# EasyEDA schematic CT.json
TITLE: Sheet_1; REV: 1.0; Date: 2021-08-13; Sheet: 1/1; Drawn By: roberttco; Company: Your Company
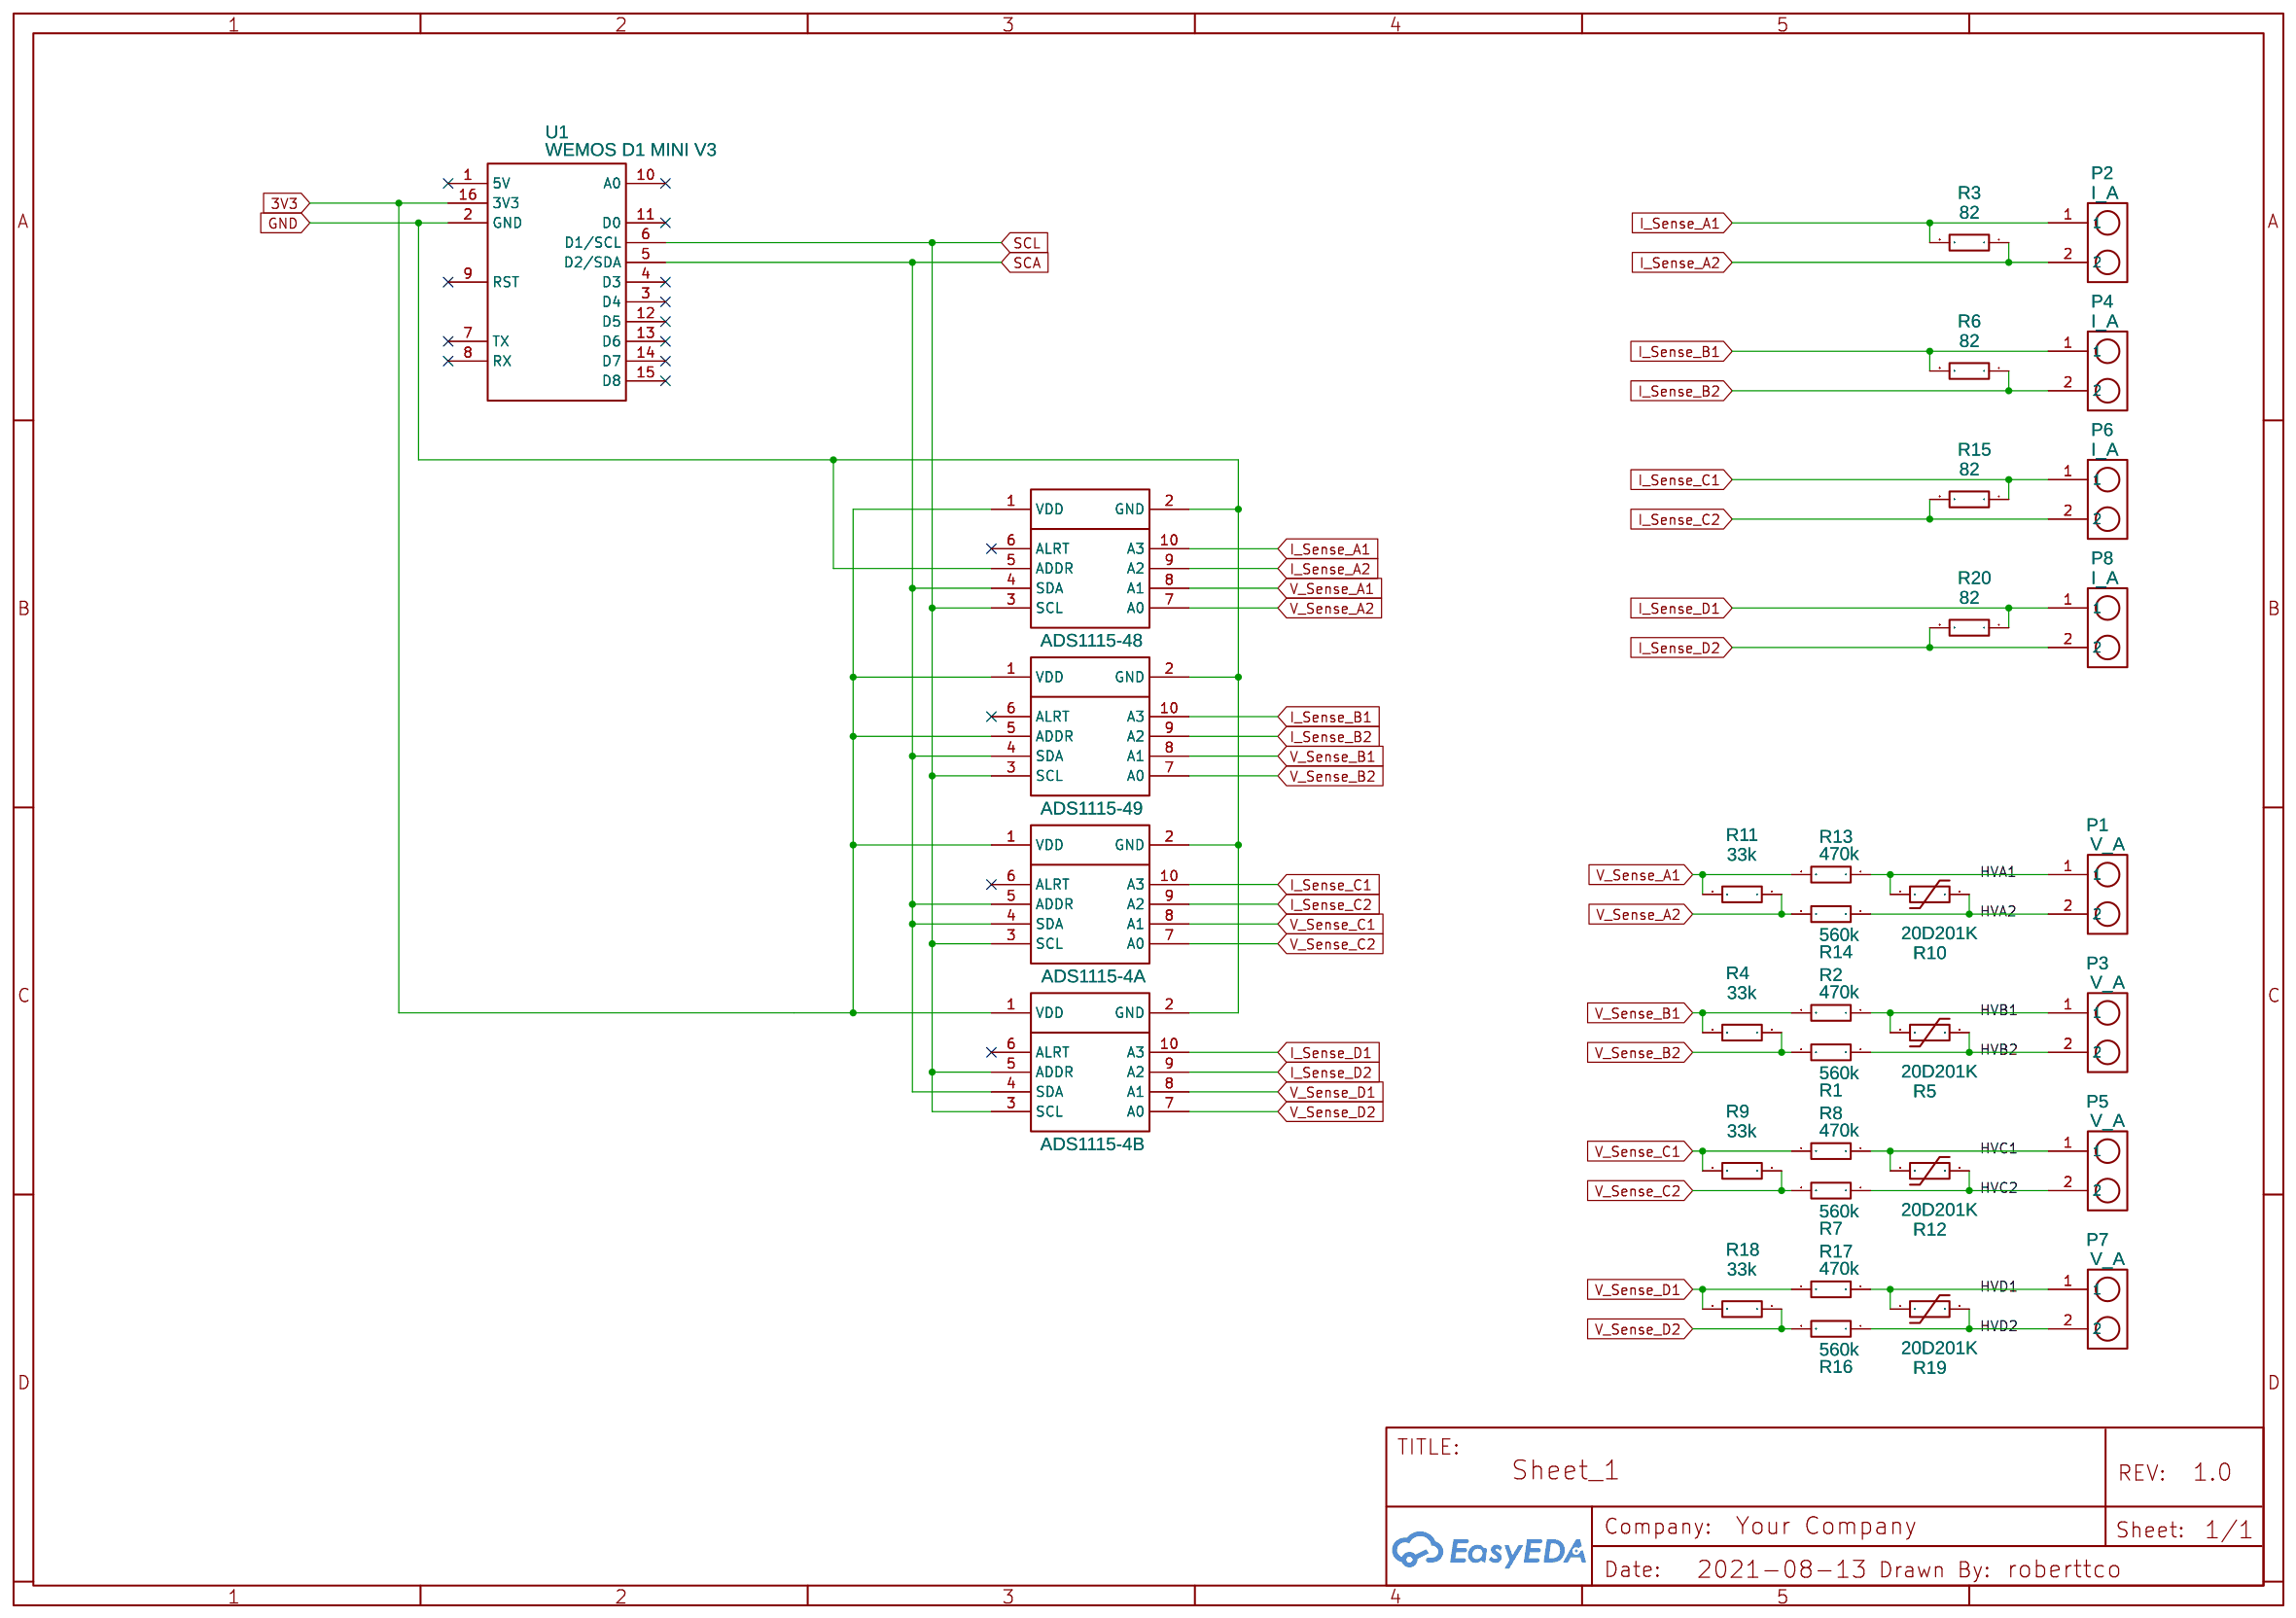
[diagram p0: schematic sheet]

## Parts
A1  ADS1115-49  [PCB ADS115]
A2  ADS1115-4A  [PCB ADS115]
A3  ADS1115-4B  [PCB ADS115]
A4  ADS1115-48  [PCB ADS115]
P1  V_A  [CONNECTOR X2]
P2  I_A  [CONNECTOR X2]
P3  V_A  [CONNECTOR X2]
P4  I_A  [CONNECTOR X2]
P5  V_A  [CONNECTOR X2]
P6  I_A  [CONNECTOR X2]
P7  V_A  [CONNECTOR X2]
P8  I_A  [CONNECTOR X2]
R1  560k  [AXIAL-6.5X2.3(1/4W)]
R2  470k  [AXIAL-6.5X2.3(1/4W)]
R3  82  [AXIAL-6.5X2.3(1/4W)]
R4  33k  [AXIAL-6.5X2.3(1/4W)]
R5  20D201K  [RES-TH_L23.0-W4.3-P10.00-SP1.70]
R6  82  [AXIAL-6.5X2.3(1/4W)]
R7  560k  [AXIAL-6.5X2.3(1/4W)]
R8  470k  [AXIAL-6.5X2.3(1/4W)]
R9  33k  [AXIAL-6.5X2.3(1/4W)]
R10  20D201K  [RES-TH_L23.0-W4.3-P10.00-SP1.70]
R11  33k  [AXIAL-6.5X2.3(1/4W)]
R12  20D201K  [RES-TH_L23.0-W4.3-P10.00-SP1.70]
R13  470k  [AXIAL-6.5X2.3(1/4W)]
R14  560k  [AXIAL-6.5X2.3(1/4W)]
R15  82  [AXIAL-6.5X2.3(1/4W)]
R16  560k  [AXIAL-6.5X2.3(1/4W)]
R17  470k  [AXIAL-6.5X2.3(1/4W)]
R18  33k  [AXIAL-6.5X2.3(1/4W)]
R19  20D201K  [RES-TH_L23.0-W4.3-P10.00-SP1.70]
R20  82  [AXIAL-6.5X2.3(1/4W)]
U1  WEMOS D1 MINI V3  [WEMOS D1 MINI]

## Library data of the parts
A1-A4 = ADS1115: Contributor: LCEDA_Lib
P1-P8 = Screw Connector x2: Manufacturer: DW; Manufacturer Part: DW; Supplier Part: DW; Contributor: Domwink
R1-R4 R6-R9 R11 R13-R18 R20 = RESISTOR: Supplier: LCSC; Supplier Part: C119347; Manufacturer: Chian Chia Elec; Contributor: LCSC
R5 R10 R12 R19 = 20D201K: Supplier: LCSC; Supplier Part: C317857; Manufacturer: COV; Contributor: LCSC; JLCPCB Part Class: Extended Part
U1 = WEMOS D1 MINI V3: Manufacturer Part: Wemos D1 mini; Contributor: ismifaizul

## Nets
3V3: A1.1(VDD) A1.5(ADDR) A2.1(VDD) A3.1(VDD) A4.1(VDD) U1.16(3V3)
GND: A1.2(GND) A2.2(GND) A3.2(GND) A4.2(GND) A4.5(ADDR) U1.2(GND)
HVA1: P1.1 R10.1 R13.1
HVA2: P1.2 R10.2 R14.1
HVB1: P3.1 R2.1 R5.1
HVB2: P3.2 R1.1 R5.2
HVC1: P5.1 R8.1 R12.1
HVC2: P5.2 R7.1 R12.2
HVD1: P7.1 R17.1 R19.1
HVD2: P7.2 R16.1 R19.2
I_Sense_A1: A4.10(A3) P2.1 R3.2
I_Sense_A2: A4.9(A2) P2.2 R3.1
I_Sense_B1: A1.10(A3) P4.1 R6.2
I_Sense_B2: A1.9(A2) P4.2 R6.1
I_Sense_C1: A2.10(A3) P6.1 R15.1
I_Sense_C2: A2.9(A2) P6.2 R15.2
I_Sense_D1: A3.10(A3) P8.1 R20.1
I_Sense_D2: A3.9(A2) P8.2 R20.2
SCA: A1.4(SDA) A2.4(SDA) A2.5(ADDR) A3.4(SDA) A4.4(SDA) U1.5(D2/SDA)
SCL: A1.3(SCL) A2.3(SCL) A3.3(SCL) A3.5(ADDR) A4.3(SCL) U1.6(D1/SCL)
V_Sense_A1: A4.8(A1) R11.2 R13.2
V_Sense_A2: A4.7(A0) R11.1 R14.2
V_Sense_B1: A1.8(A1) R2.2 R4.2
V_Sense_B2: A1.7(A0) R1.2 R4.1
V_Sense_C1: A2.8(A1) R8.2 R9.2
V_Sense_C2: A2.7(A0) R7.2 R9.1
V_Sense_D1: A3.8(A1) R17.2 R18.2
V_Sense_D2: A3.7(A0) R16.2 R18.1

Not connected (* = marked no-connect by the designer): A1 6(ALRT)*; A2 6(ALRT)*; A3 6(ALRT)*; A4 6(ALRT)*; U1 1(5V)* 3(D4)* 4(D3)* 7(TX)* 8(RX)* 9(RST)* 10(A0)* 11(D0)* 12(D5)* 13(D6)* 14(D7)* 15(D8)*
